# Altium schematic sheet PWM-DAC-PSU.SchDoc
size A4; SheetNumber: 4; SheetTotal: 5
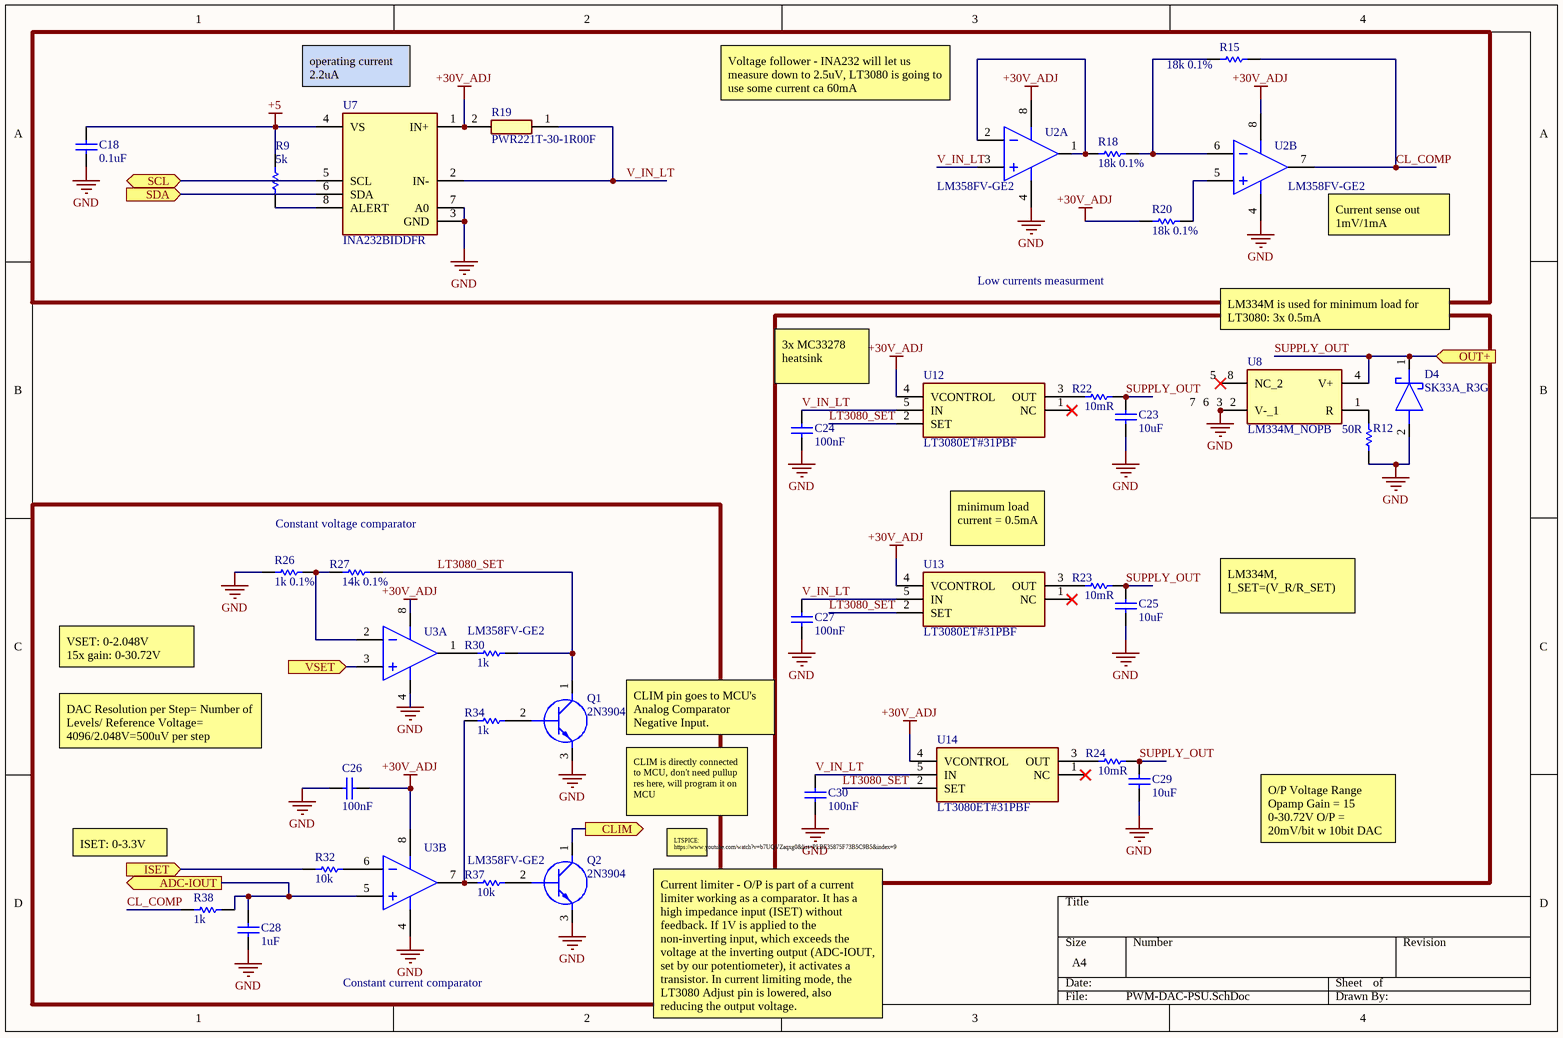
[diagram p0: PWM-DAC-PSU.SchDoc]

## Parts
C18  value 0.1uF  [Cap_0603]  (hidden comment: Cap)
C23  value 10uF  [Cap_0603]  (hidden comment: Cap)
C24  value 100nF  [Cap_0603]  (hidden comment: Cap)
C25  value 10uF  [Cap_0603]  (hidden comment: Cap)
C26  value 100nF  [Cap_0603]  (hidden comment: Cap)
C27  value 100nF  [Cap_0603]  (hidden comment: Cap)
C28  value 1uF  [Cap_0603]  (hidden comment: Cap)
C29  value 10uF  [Cap_0603]  (hidden comment: Cap)
C30  value 100nF  [Cap_0603]  (hidden comment: Cap)
D4  SK33A_R3G  [DIOM5126X250N]
Q1  2N3904  [LM431ACZ]
Q2  2N3904  [LM431ACZ]
R9  value 5k  [RES_0805]  (hidden comment: Res1)
R12  value 50R  [RES_0805]  (hidden comment: Res1)
R15  value 18k 0.1%  [RES_0805]  (hidden comment: Res1)
R18  value 18k 0.1%  [RES_0805]  (hidden comment: Res1)
R19  PWR221T-30-1R00F  [TO508P343X1041X1930-2P]
R20  value 18k 0.1%  [RES_0805]  (hidden comment: Res1)
R22  value 10mR  [RES_0805]  (hidden comment: Res1)
R23  value 10mR  [RES_0805]  (hidden comment: Res1)
R24  value 10mR  [RES_0805]  (hidden comment: Res1)
R26  value 1k 0.1%  [RES_0805]  (hidden comment: Res1)
R27  value 14k 0.1%  [RES_0805]  (hidden comment: Res1)
R30  value 1k  [RES_0805]  (hidden comment: Res1)
R32  value 10k  [RES_0805]  (hidden comment: Res1)
R34  value 1k  [RES_0805]  (hidden comment: Res1)
R37  value 10k  [RES_0805]  (hidden comment: Res1)
R38  value 1k  [RES_0805]  (hidden comment: Res1)
U2  LM358FV-GE2  [SOP65P640X135-8N]  (parts A,B of 2)
U3  LM358FV-GE2  [SOP65P640X135-8N]  (parts A,B of 2)
U7  INA232BIDDFR  [SOT65P280X110-8N]
U8  LM334M_NOPB  [SOIC127P600X175-8N]
U12  LT3080ET#31PBF  [LT3080ET31PBF]
U13  LT3080ET#31PBF  [LT3080ET31PBF]
U14  LT3080ET#31PBF  [LT3080ET31PBF]

## Blocks framed on the sheet
Low currents measurment: C18 R9 R15 R18-R20 U2 U7

## Ports
ADC-IOUT (out), CLIM (out), ISET (in), OUT+ (in), SCL (bidir), SDA (in), VSET (in)

## Nets
+5: C18.1 R9.2 U7.4(VS)
+30V_ADJ: C26.2 R19.2 R20.2 U2.8(VCC) U3.8(VCC) U7.1(IN+) U12.4(VCONTROL) U13.4(VCONTROL) U14.4(VCONTROL)
GND: C18.2 C23.1 C24.2 C25.1 C26.1 C27.2 C28.2 C29.1 C30.2 D4.2(A) Q1.3(E) Q2.3(E) R12.2 R26.1 U2.4(GND) U3.4(GND) U7.3(GND) U7.7(A0) U8.2(V-_1) U8.3(V-_2) U8.6(V-_3) U8.7(V-_4)
ADC-IOUT: C28.1 R38.2 U3.5(2IN+) ; port ADC-IOUT
CL_COMP: R15.2 R38.1 U2.7(2OUT)
CLIM: Q2.1(C) ; port CLIM
ISET: R32.2 ; port ISET
LT3080_SET: Q1.1(C) R27.2 R30.2 U12.2(SET) U13.2(SET) U14.2(SET)
SCL: U7.5(SCL) ; port SCL
SDA: U7.6(SDA) ; port SDA
SUPPLY_OUT: C23.2 C25.2 C29.2 D4.1(K) R22.1 R23.1 R24.1 U8.4(V+) ; port OUT+
V_IN_LT: C24.1 C27.1 C30.1 R19.1 U2.3(1IN+) U7.2(IN-) U12.5(IN) U13.5(IN) U14.5(IN)
VSET: U3.3(1IN+) ; port VSET
NetQ1_2: Q1.2(B) R34.2
NetQ2_2: Q2.2(B) R37.2
NetR9_1: R9.1 U7.8(ALERT)
NetR12_1: R12.1 U8.1(R)
NetR15_1: R15.1 R18.2 U2.6(2IN-)
NetR18_1: R18.1 U2.1(1OUT) U2.2(1IN-)
NetR20_1: R20.1 U2.5(2IN+)
NetR22_2: R22.2 U12.3(OUT)
NetR23_2: R23.2 U13.3(OUT)
NetR24_2: R24.2 U14.3(OUT)
NetR26_2: R26.2 R27.1 U3.2(1IN-)
NetR30_1: R30.1 U3.1(1OUT)
NetR32_1: R32.1 U3.6(2IN-)
NetR34_1: R34.1 R37.1 U3.7(2OUT)
NetU8_5: U8.5(NC_1) U8.8(NC_2)

Not connected (* = marked no-connect by the designer): U12 1(NC)*; U13 1(NC)*; U14 1(NC)*

## Notes on the sheet
- (near U7) operating current 2.2uA
- Voltage follower - INA232 will let us measure down to 2.5uV, LT3080 is going to use some current ca 60mA
- (near U2) Current sense out
  1mV/1mA
- 3x MC33278 heatsink
- LM334M is used for minimum load for LT3080: 3x 0.5mA
- Constant voltage comparator
- minimum load current = 0.5mA
- LM334M, I_SET=(V_R/R_SET)
- VSET: 0-2.048V
  15x gain: 0-30.72V
- DAC Resolution per Step= Number of Levels/ Reference Voltage=
  4096/2.048V=500uV per step
  ​
- CLIM pin goes to MCU's Analog Comparator Negative Input.
- ISET: 0-3.3V
- CLIM is directly connected to MCU, don't need pullup res here, will program it on MCU
- LTSPICE: https://www.youtube.com/watch?v=b7UQVZaqxg0&list=PLBF35875F73B5C9B5&index=9
- O/P Voltage Range
  Opamp Gain = 15
  0-30.72V O/P = 20mV/bit w 10bit DAC
- Constant current comparator
- Current limiter - O/P is part of a current limiter working as a comparator. It has a high impedance input (ISET) without feedback. If 1V is applied to the non-inverting input, which exceeds the voltage at the inverting output (ADC-IOUT, set by our potentiometer), it activates a transistor. In current limiting mode, the LT3080 Adjust pin is lowered, also reducing the output voltage.

## Library data of the parts
C18 C23-C30 = Cap: Capacitor; Published: 8-Jun-2000; LatestRevisionDate: 17-Jul-2002; LatestRevisionNote: Re-released for DXP Platform.; PackageReference: RAD-0.3; Publisher: Altium Limited; PackageDescription: Radial Cap, Thru-Hole; 2 Leads; 0.3 in Pin Spacing
D4 = SK33A_R3G: Schottky Diode; Manufacturer_Name: Taiwan Semiconductor; Manufacturer_Part_Number: SK33A R3G; Datasheet Link: https://eu.mouser.com/datasheet/2/395/SK32A%20SERIES_T1705-1140381.pdf; Height: 2.5mm; Mouser Part Number: 821-SK33AR3G; Mouser Price/Stock: https://www.mouser.co.uk/ProductDetail/Taiwan-Semiconductor/SK33A-R3G?qs=u4fy%2FsgLU9MRgnm6RX6lAA%3D%3D
Q1 Q2 = 2N3904BU: Transistor BJT NPN; Manufacturer_Name: onsemi; Datasheet Link: http://www.onsemi.com/pub/Collateral/2N3904-D.pdf; Height: 5.33mm; Manufacturer_Part_Number: 2N3904BU; Mouser Part Number: 512-2N3904BU; Mouser Price/Stock: https://www.mouser.co.uk/ProductDetail/onsemi-Fairchild/2N3904BU?qs=or4AE2qAS%252Bd0Jdpn%2F8ktKg%3D%3D; Arrow Part Number: 2N3904BU; Arrow Price/Stock: https://www.arrow.com/en/products/2n3904bu/on-semiconductor?region=europe; ComponentLink1Description: Datasheet; ComponentLink1URL: http://www.onsemi.com/pub/Collateral/2N3904-D.pdf
R9 R12 R15 R18 R20 R22-R24 R26 R27 R30 R32 R34 R37 R38 = Res1: Resistor; Published: 8-Jun-2000; LatestRevisionDate: 17-Jul-2002; LatestRevisionNote: Re-released for DXP Platform.; PackageReference: AXIAL-0.3; Publisher: Altium Limited; PackageDescription: Axial Device, Thru-Hole; 2 Leads; 0.3 in Pin Spacing
R19 = PWR221T-30-1R00F: Shunt resistor; Manufacturer_Name: Bourns; Datasheet Link: https://www.mouser.com/datasheet/2/54/pwr221t-30-777826.pdf; Height: 3.43mm; Manufacturer_Part_Number: PWR221T-30-1R00F; Mouser Part Number: 652-PWR221T-30-1R00F; Mouser Price/Stock: https://www.mouser.co.uk/ProductDetail/Bourns/PWR221T-30-1R00F?qs=XYAu1o%252BHdOJGOBAldPrG1w%3D%3D; Arrow Part Number: PWR221T-30-1R00F; Arrow Price/Stock: https://www.arrow.com/en/products/pwr221t-30-1r00f/bourns; ComponentLink1Description: Datasheet; ComponentLink1URL: https://www.mouser.com/datasheet/2/54/pwr221t-30-777826.pdf
U2 U3 = TI-LM358-8: l Operational Amplifier; ComponentLink1Description: Datasheet; ComponentLink1URL: https://www.ti.com/lit/ds/symlink/lm358.pdf?ts=1699359399522&ref_url=https%253A%252F%252Fwww.ti.com%252Fproduct%252FLM358%253Futm_source%253Dgoogle%2526utm_medium%253Dcpc%2526utm_campaign%253Dasc-null-null-GPN_EN-cpc-evm-google-wwe_cons%2526utm_content%253DLM358%2526ds_k%253DLM358%2BDatasheet%2526DCM%253Dyes%2526gclid%253DEAIaIQobChMI5uKEhe-xggMVJz4GAB1MywkTEAAYASAAEgJG8PD_BwE%2526gclsrc%253Daw.ds
  U3: Parameter 1: *; Supplier 1: Rs; Supplier Part Number 1: 1716341
U7 = INA232BIDDFR: INA232 48-V, 16-Bit, Current, Voltage, and Power Monitor With an I2C Interface; Manufacturer_Name: Texas Instruments; Datasheet Link: https://www.ti.com/lit/ds/symlink/ina232.pdf?ts=1699312390876&ref_url=https%253A%252F%252Fwww.ti.com%252Fproduct%252FINA232%253Futm_source%253Dgoogle%2526utm_medium%253Dcpc%2526utm_campaign%253Dasc-null-null-GPN_EN-cpc-pf-google-wwe_cons%2526utm_content%2; Height: 1.1mm; Manufacturer_Part_Number: INA232BIDDFR; Mouser Part Number: 595-INA232BIDDFR; Mouser Price/Stock: https://www.mouser.co.uk/ProductDetail/Texas-Instruments/INA232BIDDFR?qs=17ckDYBRdelmwH1njZdaQw%3D%3D; ComponentLink1Description: Datahseet; ComponentLink1URL: https://www.ti.com/lit/ds/symlink/ina232.pdf?HQS=dis-mous-null-mousermode-dsf-pf-null-wwe&ts=1700934645658&ref_url=https%253A%252F%252Fwww.mouser.com%252F
U8 = LM334M_NOPB: 3-Terminal Adjustable Current Source; Manufacturer_Name: Texas Instruments; Manufacturer_Part_Number: LM334M/NOPB; Datasheet Link: http://www.ti.com/lit/ds/symlink/lm334.pdf; Height: 1.75mm; Mouser Part Number: 926-LM334M/NOPB; Mouser Price/Stock: https://www.mouser.co.uk/ProductDetail/Texas-Instruments/LM334M-NOPB?qs=X1J7HmVL2ZGVqL5LPYoDQw%3D%3D; Arrow Part Number: LM334M/NOPB; Arrow Price/Stock: https://www.arrow.com/en/products/lm334mnopb/texas-instruments?region=nac; ComponentLink1Description: Datasheet; ComponentLink1URL: https://www.ti.com/lit/ds/symlink/lm134.pdf?ts=1700986476311&ref_url=https%253A%252F%252Fwww.google.com%252F
U12-U14 = LT3080ET#31PBF: Adjustable 1.1A Single Resistor Low Dropout Regulator; Manufacturer_Name: Analog Devices; Datasheet Link: https://www.analog.com/media/en/technical-documentation/data-sheets/3080fc.pdf; Height: 15.748mm; Manufacturer_Part_Number: LT3080ET#31PBF; Mouser Part Number: 584-LT3080ET#31PBF; Mouser Price/Stock: https://www.mouser.co.uk/ProductDetail/Analog-Devices/LT3080ET31PBF?qs=hVkxg5c3xu%252BqtsodQH9qig%3D%3D; Arrow Part Number: LT3080ET#31PBF; Arrow Price/Stock: https://www.arrow.com/en/products/lt3080et31pbf/analog-devices?region=nac; ComponentLink1Description: Datasheet; ComponentLink1URL: https://www.analog.com/media/en/technical-documentation/data-sheets/lt3080.pdf